# Altium schematic sheet USB-Switch.SchDoc
size A4
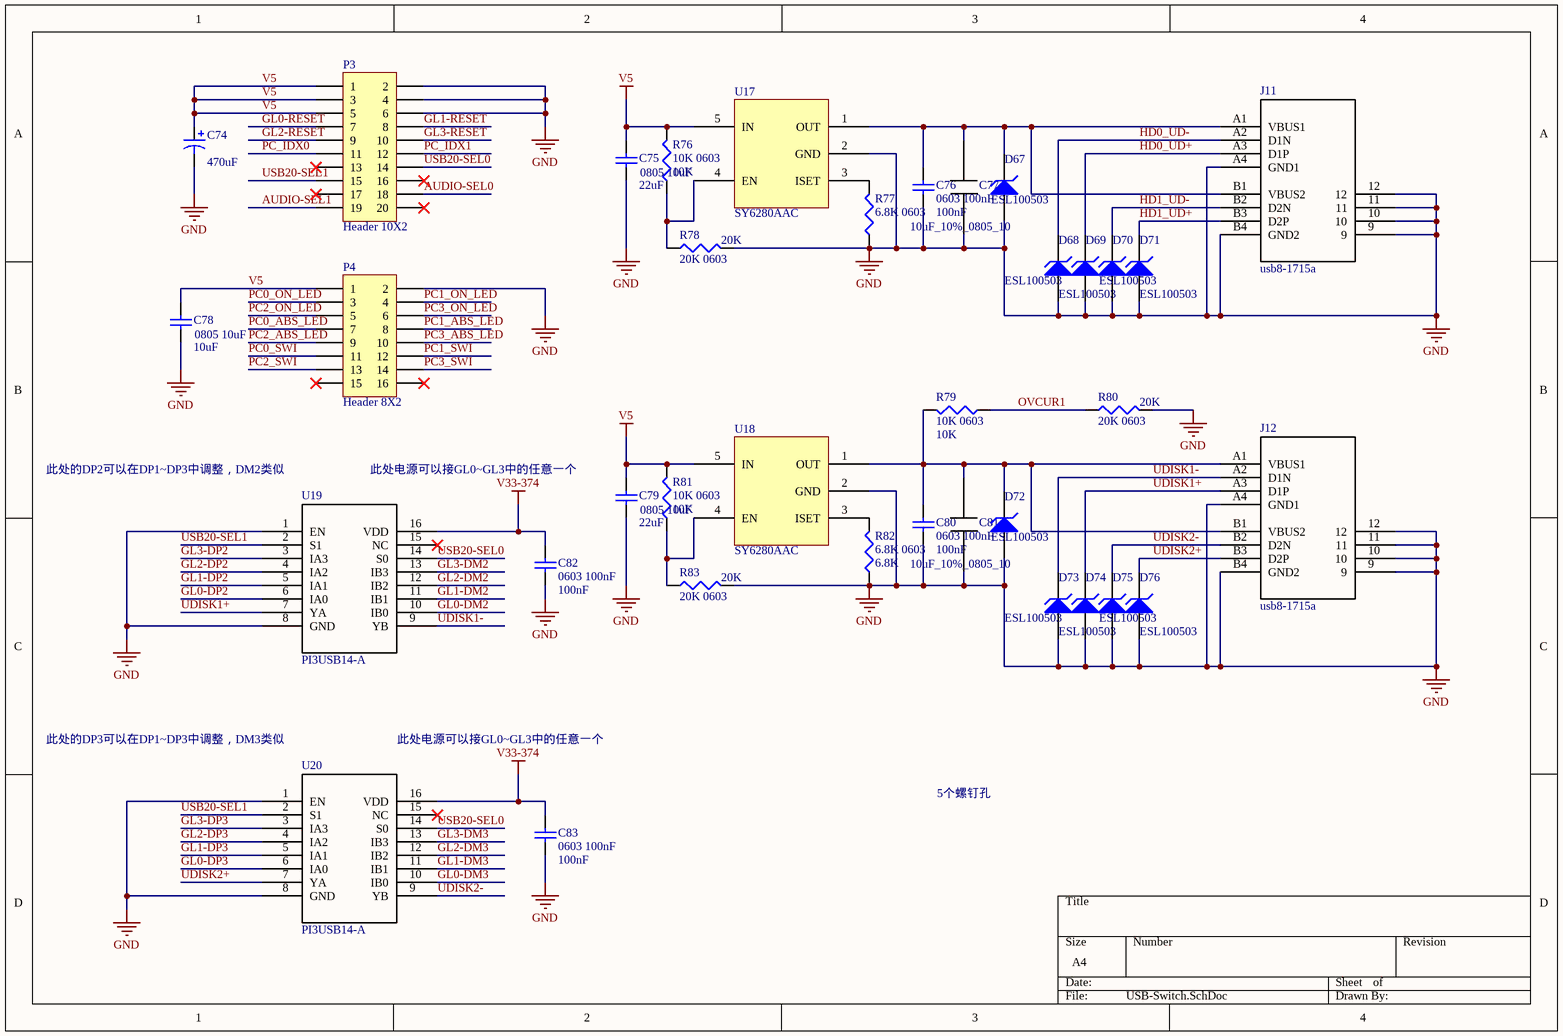
[diagram p0: USB-Switch.SchDoc]

## Parts
C74  470uF  [RB7_6-15]
C75  0805 10uF  value 22uF  [C0805]
C76  0603 100nF  value 100nF  [C0603]
C77  10uF_10%_0805_10  [C0805]
C78  0805 10uF  value 10uF  [C0805]
C79  0805 10uF  value 22uF  [C0805]
C80  0603 100nF  value 100nF  [C0603]
C81  10uF_10%_0805_10  [C0805]
C82  0603 100nF  value 100nF  [C0603]
C83  0603 100nF  value 100nF  [C0603]
D67  ESL100503  [C0402]
D68  ESL100503  [C0402]
D69  ESL100503  [C0402]
D70  ESL100503  [C0402]
D71  ESL100503  [C0402]
D72  ESL100503  [C0402]
D73  ESL100503  [C0402]
D74  ESL100503  [C0402]
D75  ESL100503  [C0402]
D76  ESL100503  [C0402]
J11  usb8-1715a  [usb8-1715a]
J12  usb8-1715a  [usb8-1715a]
P3  Header 10X2  [HDR2X10]
P4  Header 8X2  [HDR2X8]
R76  10K 0603  value 10K  [R0603]
R77  6.8K 0603  [R0603]
R78  20K 0603  value 20K  [R0603]
R79  10K 0603  value 10K  [R0603]
R80  20K 0603  value 20K  [R0603]
R81  10K 0603  value 10K  [R0603]
R82  6.8K 0603  value 6.8K  [R0603]
R83  20K 0603  value 20K  [R0603]
U17  SY6280AAC  [SOT23-5]
U18  SY6280AAC  [SOT23-5]
U19  PI3USB14-A  [sop16-26-064a]
U20  PI3USB14-A  [sop16-26-064a]

## Nets
GND: C74.2 C75.1 C76.1 C77.1 C78.1 C79.1 C80.1 C81.1 C82.1 C83.1 D67.1(A) D68.1(A) D69.1(A) D70.1(A) D71.1(A) D72.1(A) D73.1(A) D74.1(A) D75.1(A) D76.1(A) J11.9 J11.10 J11.11 J11.12 J11.A4(GND1) J11.B4(GND2) J12.9 J12.10 J12.11 J12.12 J12.A4(GND1) J12.B4(GND2) P3.2 P3.4 P3.6 P4.2 R77.1 R78.2 R80.2 R82.1 R83.2 U17.2(GND) U18.2(GND) U19.1(EN) U19.8(GND) U20.1(EN) U20.8(GND)
V5: C74.1 C75.2 C78.2 C79.2 P3.1 P3.3 P3.5 P4.1 R76.2 R81.2 U17.5(IN) U18.5(IN)
V33-374: C82.2 C83.2 U19.16(VDD) U20.16(VDD)
AUDIO-SEL0: P3.18
AUDIO-SEL1: P3.19
GL0-DM2: U19.10(IB0)
GL0-DM3: U20.10(IB0)
GL0-DP2: U19.6(IA0)
GL0-DP3: U20.6(IA0)
GL0-RESET: P3.7
GL1-DM2: U19.11(IB1)
GL1-DM3: U20.11(IB1)
GL1-DP2: U19.5(IA1)
GL1-DP3: U20.5(IA1)
GL1-RESET: P3.8
GL2-DM2: U19.12(IB2)
GL2-DM3: U20.12(IB2)
GL2-DP2: U19.4(IA2)
GL2-DP3: U20.4(IA2)
GL2-RESET: P3.9
GL3-DM2: U19.13(IB3)
GL3-DM3: U20.13(IB3)
GL3-DP2: U19.3(IA3)
GL3-DP3: U20.3(IA3)
GL3-RESET: P3.10
HD0_UD+: D69.2(K) J11.A3(D1P)
HD0_UD-: D68.2(K) J11.A2(D1N)
HD1_UD+: D71.2(K) J11.B3(D2P)
HD1_UD-: D70.2(K) J11.B2(D2N)
OVCUR1: R79.1 R80.1
PC0_ABS_LED: P4.7
PC0_ON_LED: P4.3
PC0_SWI: P4.11
PC1_ABS_LED: P4.8
PC1_ON_LED: P4.4
PC1_SWI: P4.12
PC2_ABS_LED: P4.9
PC2_ON_LED: P4.5
PC2_SWI: P4.13
PC3_ABS_LED: P4.10
PC3_ON_LED: P4.6
PC3_SWI: P4.14
PC_IDX0: P3.11
PC_IDX1: P3.12
UDISK1+: D74.2(K) J12.A3(D1P) U19.7(YA)
UDISK1-: D73.2(K) J12.A2(D1N) U19.9(YB)
UDISK2+: D76.2(K) J12.B3(D2P) U20.7(YA)
UDISK2-: D75.2(K) J12.B2(D2N) U20.9(YB)
USB20-SEL0: P3.14 U19.14(S0) U20.14(S0)
USB20-SEL1: P3.15 U19.2(S1) U20.2(S1)
NetC76_2: C76.2 C77.2 D67.2(K) J11.A1(VBUS1) J11.B1(VBUS2) U17.1(OUT)
NetC80_2: C80.2 C81.2 D72.2(K) J12.A1(VBUS1) J12.B1(VBUS2) R79.2 U18.1(OUT)
NetR76_1: R76.1 R78.1 U17.4(EN)
NetR77_2: R77.2 U17.3(ISET)
NetR81_1: R81.1 R83.1 U18.4(EN)
NetR82_2: R82.2 U18.3(ISET)

Not connected (* = marked no-connect by the designer): P3 13* 16* 17* 20*; P4 15* 16*; U19 15(NC)*; U20 15(NC)*

## Notes on the sheet
- 此处的DP2可以在DP1~DP3中调整，DM2类似
- 此处电源可以接GL0~GL3中的任意一个
- 此处的DP3可以在DP1~DP3中调整，DM3类似
- 5个螺钉孔

## Library data of the parts
C74 = Cap Pol1: Polarized Capacitor (Radial); Published: 8-Jun-2000; LatestRevisionDate: 17-Jul-2002; LatestRevisionNote: Re-released for DXP Platform.; PackageReference: RB7.6-15; Publisher: Altium Limited; PackageDescription: Polarized Capacitor (Radial); 2 Leads; Value: 470uF
C75 C76 C78-C80 C82 C83 = Cap Semi: Capacitor (Semiconductor SIM Model); Published: 8-Jun-2000; LatestRevisionDate: 29-May-2009; LatestRevisionNote: IPC-7351 Footprint Added.; PackageReference: C1206; Publisher: Altium Limited; PackageDescription: Chip Capacitor
C77 C81 = 10uF_10%_0805_10: Imported; Component: 10uF_10%_0805_10V_CA; Device: 0805ZC106KAT2A; Designer: Chiphome; CHcode: CAPC1850476; Type: DEV; Value: Value; Footprint: sc0805a; RefDes: RefDes
D67-D76 = D Zener: Published: 8-Jun-2000; LatestRevisionDate: 17-Jul-2002; LatestRevisionNote: Re-released for DXP Platform.; PackageReference: DIODE-0.7; Publisher: Altium Limited; PackageDescription: Diode, Thru-Hole; 2 Leads; 0.7 in Pin Spacing
J11 J12 = usb8-1715a: Imported; RefDes: RefDes; Type: DEV; Value: Value
P3 = Header 10X2: Header, 10-Pin, Dual row; LatestRevisionDate: 17-Jul-2002; LatestRevisionNote: Re-released for DXP Platform.; Publisher: Altium Limited
P4 = Header 8X2: Header, 8-Pin, Dual row; LatestRevisionDate: 17-Jul-2002; LatestRevisionNote: Re-released for DXP Platform.; Publisher: Altium Limited
R76-R83 = Res3: Resistor; Published: 8-Jun-2000; LatestRevisionDate: 29-May-2009; LatestRevisionNote: IPC-7351 Footprint Added.; PackageReference: J1-0603; Publisher: Altium Limited; PackageDescription: Chip Resistor
  R77: Value: 6.8K
U17 U18 = Component_1
U19 U20 = PI3USB14-A: Imported; Designer: Chiphome; Device: PI3USB14-A; RefDes: RefDes; Type: DEV; Value: Value